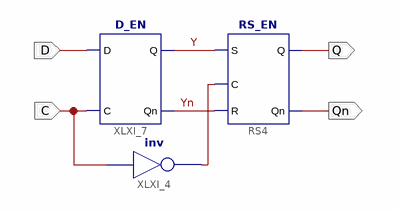
[diagram p0: schematic sheet 1]
// Xilinx ISE schematic D_Trig.sch (kintex7) as structural Verilog: 3 symbols, 4 ports
module D_Trig (
  input  C,
  input  D,
  output Q,
  output Qn
);

  wire XLXN_7, Y, Yn;

  RS_EN RS4 (.Q(Q), .Qn(Qn), .C(XLXN_7), .S(Y), .R(Yn));
  not XLXI_4 (XLXN_7, C);
  D_EN XLXI_7 (.D(D), .C(C), .Q(Y), .Qn(Yn));
endmodule
